# Altium schematic sheet 消防背表 备份.SchDoc
size A2
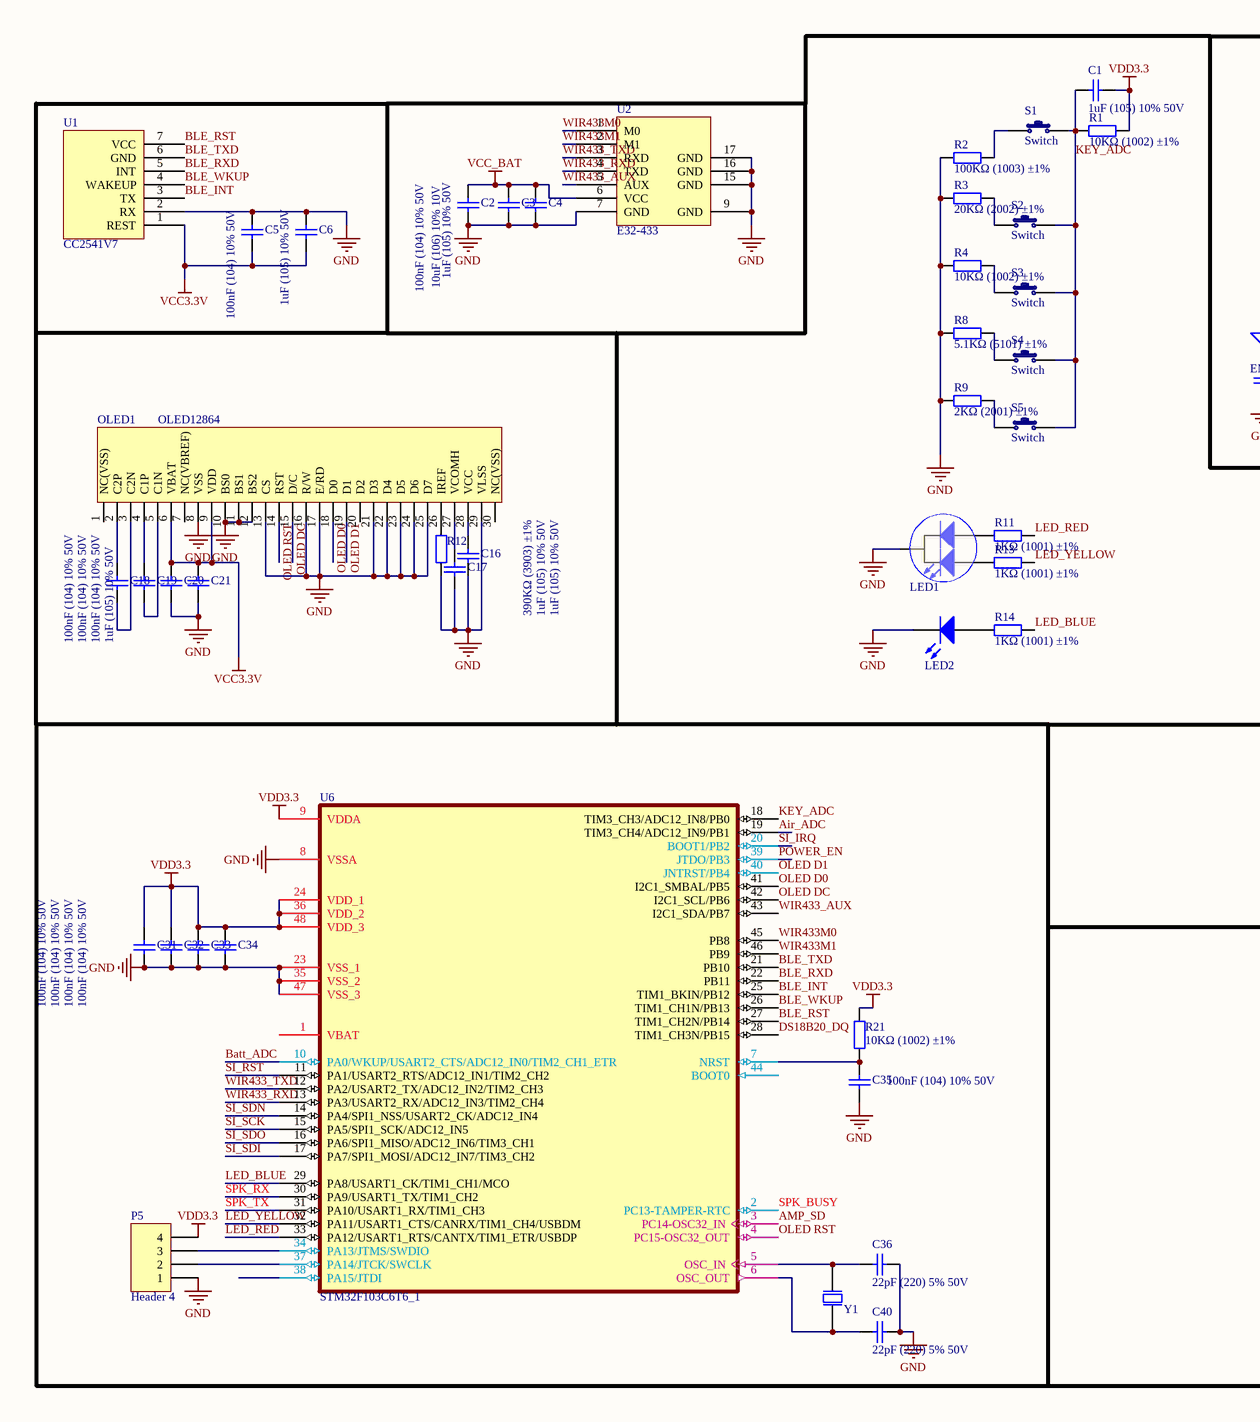
[diagram p0: 消防背表 备份.SchDoc, left]
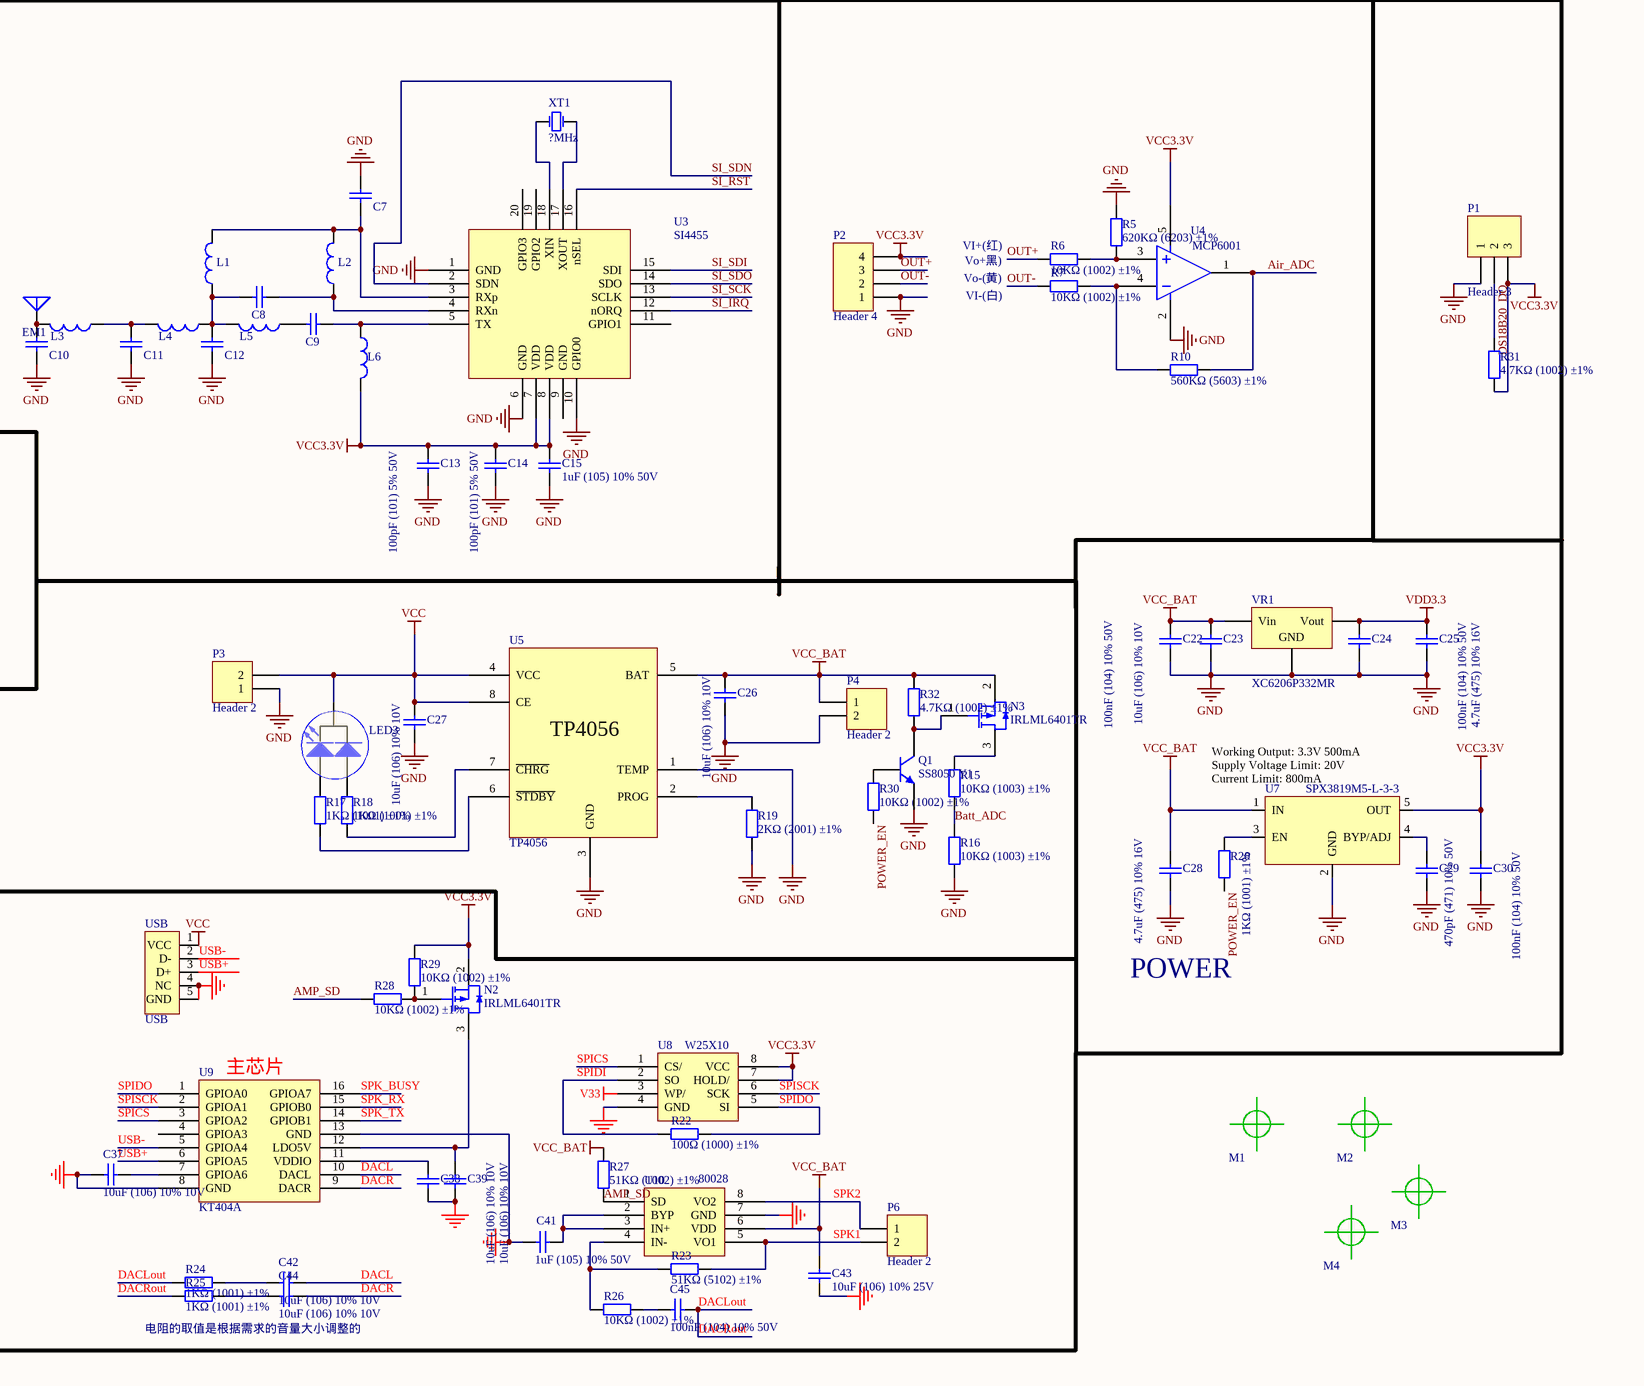
[diagram p1: 消防背表 备份.SchDoc, right]

## Parts
C1  1uF (105) 10% 50V  [0603_C]
C2  1uF (105) 10% 50V  [0603_C]
C3  10uF (106) 10% 10V  [0603_C]
C4  100nF (104) 10% 50V  [0603_C]
C5  100nF (104) 10% 50V  [0603_C]
C6  1uF (105) 10% 50V  [0603_C]
C7  Cap Chip  [CAPC1608N]  (value not drawn)
C8  Cap Chip  [CAPC1608N]  (value not drawn)
C9  Cap Chip  [CAPC1608N]  (value not drawn)
C10  Cap Chip  [CAPC1608N]  (value not drawn)
C11  Cap Chip  [CAPC1608N]  (value not drawn)
C12  Cap Chip  [CAPC1608N]  (value not drawn)
C13  100pF (101) 5% 50V  [0603_C]
C14  100pF (101) 5% 50V  [0603_C]
C15  1uF (105) 10% 50V  [0603_C]
C16  1uF (105) 10% 50V  [0603_C]
C17  1uF (105) 10% 50V  [0603_C]
C18  100nF (104) 10% 50V  [0603_C]
C19  100nF (104) 10% 50V  [0603_C]
C20  100nF (104) 10% 50V  [0603_C]
C21  1uF (105) 10% 50V  [0603_C]
C22  100nF (104) 10% 50V  [0603_C]
C23  10uF (106) 10% 10V  [0603_C]
C24  4.7uF (475) 10% 16V  [0603_C]
C25  100nF (104) 10% 50V  [0603_C]
C26  10uF (106) 10% 10V  [0603_C]
C27  10uF (106) 10% 10V  [0603_C]
C28  4.7uF (475) 10% 16V  [0603_C]
C29  470pF (471) 10% 50V  [0603_C]
C30  100nF (104) 10% 50V  [0603_C]
C31  100nF (104) 10% 50V  [0603_C]
C32  100nF (104) 10% 50V  [0603_C]
C33  100nF (104) 10% 50V  [0603_C]
C34  100nF (104) 10% 50V  [0603_C]
C35  100nF (104) 10% 50V  [0603_C]
C36  22pF (220) 5% 50V  [0603_C]
C37  10uF (106) 10% 10V  [0603_C]
C38  10uF (106) 10% 10V  [0603_C]
C39  10uF (106) 10% 10V  [0603_C]
C40  22pF (220) 5% 50V  [0603_C]
C41  1uF (105) 10% 50V  [0603_C]
C42  10uF (106) 10% 10V  [0603_C]
C43  10uF (106) 10% 25V  [0805_C]
C44  10uF (106) 10% 10V  [0603_C]
C45  100nF (104) 10% 50V  [0603_C]
EM1  Ant_2.4G  [ANT_2.4G]  (value not drawn)
L1  Inductor Chip  [CR1608-0603]  (value not drawn)
L2  Inductor Chip  [CR1608-0603]  (value not drawn)
L3  Inductor Chip  [CR1608-0603]  (value not drawn)
L4  Inductor Chip  [CR1608-0603]  (value not drawn)
L5  Inductor Chip  [CR1608-0603]  (value not drawn)
L6  Inductor Chip  [CR1608-0603]  (value not drawn)
LED1  LED-3-DOUBLE  [LED-R3-H5-DOUBLE]  (value not drawn)
LED2  LED Chip  [CLED1608-0603]  (value not drawn)
LED3  LED-3-DOUBLE  [LED-R3-H5-DOUBLE]  (value not drawn)
M1  Screw Hole  [Screw hexagon 3mm]  (value not drawn)
M2  Screw Hole  [Screw hexagon 3mm]  (value not drawn)
M3  Screw Hole  [Screw hexagon 3mm]  (value not drawn)
M4  Screw Hole  [Screw hexagon 3mm]  (value not drawn)
N2  value IRLML6401TR  [SOT23-3]  (hidden comment: P-MOS)
N3  value IRLML6401TR  [SOT23-3]  (hidden comment: P-MOS)
OLED1  OLED12864  [OLED_0.96]
P1  Header 3  [HX2.54-3]
P2  Header 4  [HX2.54-4]
P3  Header 2  [HDR1X2]
P4  Header 2  [MOLEX 35363-0250]
P5  Header 4  [HDR1X4]
P6  Header 2  [HDR1X2]
Q1  SS8050 Y1  [SOT-23(SOT-23-3)]
R1  10KΩ (1002) ±1%  [0603_R]
R2  100KΩ (1003) ±1%  [0603_R]
R3  20KΩ (2002) ±1%  [0603_R]
R4  10KΩ (1002) ±1%  [0603_R]
R5  620KΩ (6203) ±1%  [0603_R]
R6  10KΩ (1002) ±1%  [0603_R]
R7  10KΩ (1002) ±1%  [0603_R]
R8  5.1KΩ (5101) ±1%  [0603_R]
R9  2KΩ (2001) ±1%  [0603_R]
R10  560KΩ (5603) ±1%  [0603_R]
R11  1KΩ (1001) ±1%  [0603_R]
R12  390KΩ (3903) ±1%  [0603_R]
R13  1KΩ (1001) ±1%  [0603_R]
R14  1KΩ (1001) ±1%  [0603_R]
R15  10KΩ (1003) ±1%  [0603_R]
R16  10KΩ (1003) ±1%  [0603_R]
R17  1KΩ (1001) ±1%  [0603_R]
R18  1KΩ (1001) ±1%  [0603_R]
R19  2KΩ (2001) ±1%  [0603_R]
R20  1KΩ (1001) ±1%  [0603_R]
R21  10KΩ (1002) ±1%  [0603_R]
R22  100Ω (1000) ±1%  [0603_R]
R23  51KΩ (5102) ±1%  [0603_R]
R24  1KΩ (1001) ±1%  [0603_R]
R25  1KΩ (1001) ±1%  [0603_R]
R26  10KΩ (1002) ±1%  [0603_R]
R27  51KΩ (1002) ±1%  [0603_R]
R28  10KΩ (1002) ±1%  [0603_R]
R29  10KΩ (1002) ±1%  [0603_R]
R30  10KΩ (1002) ±1%  [0603_R]
R31  4.7KΩ (1002) ±1%  [0603_R]
R32  4.7KΩ (1002) ±1%  [0603_R]
S1  Switch  [Switch1]
S2  Switch  [Switch1]
S3  Switch  [Switch1]
S4  Switch  [Switch1]
S5  Switch  [Switch1]
U1  CC2541V7  [BLE_CC2451]
U2  E32-433  [E32_433]
U3  SI4455  [QFN50P300X300X80-20N]
U4  MCP6001  [SOT23-5]
U5  TP4056  [SOP-8_150mil]
U6  STM32F103C6T6_1  [LQFP-48]
U7  SPX3819M5-L-3-3  [SOT-23-6]
U8  W25X10  [SOIC127P790X265-8N]
U9  KT404A  [SOP-16M]
U10  80028  [SOP-8_150mil]
USB  USB  [USB-MICRO-B]
VR1  XC6206P332MR  [SOT-23-3L]
XT1  value ?MHz  [XTAL_5032]  (hidden comment: XTAL_5032)
Y1  XTAL  [XTAL-SMD]  (value not drawn)

## Nets
GND: C2.1 C3.1 C4.1 C5.2 C6.2 C7.2 C10.1 C11.1 C12.1 C13.2 C14.2 C15.1 C16.1 C17.1 C20.1 C21.1 C22.1 C23.1 C24.1 C25.1 C26.1 C27.1 C28.1 C29.1 C30.1 C31.1 C32.1 C33.1 C34.1 C35.1 C36.2 C37.2 C38.2 C39.2 C40.2 C41.1 C43.1 LED1.1(K) LED2.2(K) OLED1.8(VSS) OLED1.10(BS0) OLED1.11(BS1) OLED1.12(BS2) OLED1.13(CS) OLED1.16(R/W) OLED1.17(E/RD) OLED1.21(D3) OLED1.22(D4) OLED1.23(D5) OLED1.24(D6) OLED1.25(D7) OLED1.29(VLSS) P1.1 P2.1 P3.1 P4.2 P5.1 Q1.2(E) R2.1 R3.1 R4.1 R5.2 R8.1 R9.1 R12.1 R16.1 R19.1 U1.2(RX) U2.7(GND) U2.9(GND) U2.15(GND) U2.16(GND) U2.17(GND) U3.1(GND) U3.6(GND) U3.10(GPIO0) U4.2 U5.1(TEMP) U5.3(GND) U6.8(VSSA) U6.23(VSS_1) U6.35(VSS_2) U6.47(VSS_3) U7.2(GND) U8.4(GND) U9.8(GND) U9.13(GND) U10.7(GND) USB.4(NC) USB.5(GND) VR1.1(GND)
V33: U8.3(WP/)
VCC: C27.2 LED3.1(K) P3.2 U5.4(VCC) U5.8(CE) USB.1(VCC)
VCC3.3V: C5.1 C6.1 C13.1 C14.1 C15.2 C20.2 C21.2 C30.2 L6.2 N2.2(S) OLED1.6(VBAT) OLED1.9(VDD) P1.3 P2.4 R29.1 R31.2 U1.1(REST) U3.7(VDD) U3.8(VDD) U4.5 U7.5(OUT) U8.7(HOLD/) U8.8(VCC)
VCC_BAT: C2.2 C3.2 C4.2 C22.2 C23.2 C26.2 C28.2 C43.2 N3.2(S) P4.1 R27.2 R32.1 U2.6(VCC) U5.5(BAT) U7.1(IN) U10.6(VDD) VR1.3(Vin)
VDD3.3: C1.1 C24.2 C25.2 C31.2 C32.2 C33.2 C34.2 P5.4 R1.2 R21.2 U6.9(VDDA) U6.24(VDD_1) U6.36(VDD_2) U6.48(VDD_3) VR1.2(Vout)
Air_ADC: R10.2 U4.1 U6.19(TIM3_CH4/ADC12_IN9/PB1)
AMP_SD: R27.1 R28.2 U6.3(PC14-OSC32_IN) U10.1(SD)
Batt_ADC: R15.1 R16.2 U6.10(PA0/WKUP/USART2_CTS/ADC12_IN0/TIM2_CH1_ETR)
BLE_INT: U1.3(TX) U6.25(TIM1_BKIN/PB12)
BLE_RST: U1.7(VCC) U6.27(TIM1_CH2N/PB14)
BLE_RXD: U1.5(INT) U6.22(PB11)
BLE_TXD: U1.6(GND) U6.21(PB10)
BLE_WKUP: U1.4(WAKEUP) U6.26(TIM1_CH1N/PB13)
DACL: C42.1 U9.10(DACL)
DACLout: C45.1 R24.2 R25.2  [also labelled DACRout]
DACR: C44.1 U9.9(DACR)
DS18B20_DQ: P1.2 R31.1 U6.28(TIM1_CH3N/PB15)
KEY_ADC: C1.2 R1.1 S1.2 S2.2 S3.2 S4.2 S5.2 U6.18(TIM3_CH3/ADC12_IN8/PB0)
LED_BLUE: R14.1 U6.29(PA8/USART1_CK/TIM1_CH1/MCO)
LED_RED: R11.1 U6.33(PA12/USART1_RTS/CANTX/TIM1_ETR/USBDP)
LED_YELLOW: R13.1 U6.32(PA11/USART1_CTS/CANRX/TIM1_CH4/USBDM)
OLED D0: OLED1.18(D0) U6.41(I2C1_SMBAL/PB5)
OLED D1: OLED1.19(D1) U6.40(JNTRST/PB4)
OLED DC: OLED1.15(D/C) U6.42(I2C1_SCL/PB6)
OLED RST: OLED1.14(RST) U6.4(PC15-OSC32_OUT)
OUT+: P2.3 R6.1
OUT-: P2.2 R7.1
POWER_EN: R20.2 R30.2 U6.39(JTDO/PB3)
SI_IRQ: U3.12(nORQ) U6.20(BOOT1/PB2)
SI_RST: U3.16(nSEL) U6.11(PA1/USART2_RTS/ADC12_IN1/TIM2_CH2)
SI_SCK: U3.13(SCLK) U6.15(PA5/SPI1_SCK/ADC12_IN5)
SI_SDI: U3.15(SDI) U6.17(PA7/SPI1_MOSI/ADC12_IN7/TIM3_CH2)
SI_SDN: U3.2(SDN) U6.14(PA4/SPI1_NSS/USART2_CK/ADC12_IN4)
SI_SDO: U3.14(SDO) U6.16(PA6/SPI1_MISO/ADC12_IN6/TIM3_CH1)
SPICS: U8.1(CS/) U9.3(GPIOA2)
SPIDI: R22.1 U8.2(SO)
SPIDO: R22.2 U8.5(SI) U9.1(GPIOA0)
SPISCK: U8.6(SCK) U9.2(GPIOA1)
SPK1: P6.2 R23.2 U10.5(VO1)
SPK2: P6.1 U10.8(VO2)
SPK_BUSY: U6.2(PC13-TAMPER-RTC) U9.16(GPIOA7)
SPK_RX: U6.30(PA9/USART1_TX/TIM1_CH2) U9.15(GPIOB0)
SPK_TX: U6.31(PA10/USART1_RX/TIM1_CH3) U9.14(GPIOB1)
USB+: U9.6(GPIOA5) USB.3(D+)
USB-: U9.5(GPIOA4) USB.2(D-)
WIR433_AUX: U2.5(AUX) U6.43(I2C1_SDA/PB7)
WIR433_RXD: U2.4(TXD) U6.13(PA3/USART2_RX/ADC12_IN3/TIM2_CH4)
WIR433_TXD: U2.3(RXD) U6.12(PA2/USART2_TX/ADC12_IN2/TIM2_CH3)
WIR433M0: U2.1(M0) U6.45(PB8)
WIR433M1: U2.2(M1) U6.46(PB9)
NetC7_1: C7.1 L1.2 L2.2 U3.3(RXp)
NetC8_1: C8.1 L2.1 U3.4(RXn)
NetC8_2: C8.2 C12.2 L1.1 L4.1 L5.2
NetC9_1: C9.1 L6.1 U3.5(TX)
NetC9_2: C9.2 L5.1
NetC10_2: C10.2 EM1.1(A) L3.2
NetC11_2: C11.2 L3.1 L4.2
NetC16_2: C16.2 OLED1.28(VCC)
NetC17_2: C17.2 OLED1.27(VCOMH)
NetC18_1: C18.1 OLED1.3(C2N)
NetC18_2: C18.2 OLED1.2(C2P)
NetC19_1: C19.1 OLED1.5(C1N)
NetC19_2: C19.2 OLED1.4(C1P)
NetC29_2: C29.2 U7.4(BYP/ADJ)
NetC35_2: C35.2 R21.1 U6.7(NRST)
NetC36_1: C36.1 U6.5(OSC_IN) Y1.2(OSC2)
NetC37_1: C37.1 U9.7(GPIOA6)
NetC38_1: C38.1 U9.11(VDDIO)
NetC39_1: C39.1 N2.3(D) U9.12(LDO5V)
NetC40_1: C40.1 U6.6(OSC_OUT) Y1.1(OSC1)
NetC41_2: C41.2 U10.2(BYP) U10.3(IN+)
NetC42_2: C42.2 R24.1
NetC44_2: C44.2 R25.1
NetC45_2: C45.2 R26.2
NetLED1_2: LED1.2(A) R13.2
NetLED1_3: LED1.3(A) R11.2
NetLED2_1: LED2.1(A) R14.2
NetLED3_2: LED3.2(A) R17.2
NetLED3_3: LED3.3(A) R18.2
NetN2_1: N2.1(G) R28.1 R29.2
NetN3_1: N3.1(G) Q1.3(C) R32.2
NetN3_3: N3.3(D) R15.2
NetOLED1_26: OLED1.26(IREF) R12.2
NetP5_2: P5.2 U6.37(PA14/JTCK/SWCLK)
NetP5_3: P5.3 U6.34(PA13/JTMS/SWDIO)
NetQ1_1: Q1.1(B) R30.1
NetR2_2: R2.2 S1.1
NetR3_2: R3.2 S2.1
NetR4_2: R4.2 S3.1
NetR5_1: R5.1 R6.2 U4.3
NetR7_2: R7.2 R10.1 U4.4
NetR8_2: R8.2 S4.1
NetR9_2: R9.2 S5.1
NetR17_1: R17.1 U5.6(~{STDBY})
NetR18_1: R18.1 U5.7(~{CHRG})
NetR19_2: R19.2 U5.2(PROG)
NetR20_1: R20.1 U7.3(EN)
NetR23_1: R23.1 R26.1 U10.4(IN-)
NetU3_17: U3.17(XOUT) XT1.2(OSC2)
NetU3_18: U3.18(XIN) XT1.1(OSC1)

Not connected (* = marked no-connect by the designer): OLED1 1(NC(VSS)) 7(NC(VBREF)) 20(D2) 30(NC(VSS)); U3 9(GND) 11(GPIO1) 19(GPIO2) 20(GPIO3); U6 1(VBAT) 38(PA15/JTDI) 44(BOOT0); U9 4(GPIOA3)

## Notes on the sheet
- VI+(红)
- Vo-(黄)
- Vo+黑)
- VI-(白)
- (near U7) Working Output: 3.3V 500mA
  Supply Voltage Limit: 20V
  Current Limit: 800mA
- POWER
- (near U9) 主芯片
- 电阻的取值是根据需求的音量大小调整的

## Library data of the parts
C1 C2 C6 C15-C17 C21 C41 = 0603 1uF (105) 10% 50V: 贴片电容; ComponentLink1Description: 供应商链接; ComponentLink1URL: http://www.szlcsc.com/product/details_16531.html; Package: 0603; Supplier: LC; SuppliersPartNumber: C15849
C3 C23 C26 C27 C37-C39 C42 C44 = 0603 10uF (106) 10% 10V: 贴片电容; ComponentLink1Description: 供应商链接; ComponentLink1URL: http://www.szlcsc.com/product/details_20411.html; Package: 0603; Supplier: LC; SuppliersPartNumber: C19702
C4 C5 C18-C20 C22 C25 C30-C35 C45 = 0603 100nF (104) 10% 50V: 贴片电容; ComponentLink1Description: 供应商链接; ComponentLink1URL: http://www.szlcsc.com/product/details_15331.html; Package: 0603; Supplier: LC; SuppliersPartNumber: C14663
C7-C12 = Cap Chip: Polarized Capacitor (Radial); Value: 104; Published: 8-Jun-2000; Revision: July-2002: Re-released for DXP Platform.; Publisher: Altium Limited
C13 C14 = 0603 100pF (101) 5% 50V: 贴片电容; ComponentLink1Description: 供应商链接; ComponentLink1URL: http://www.szlcsc.com/product/details_15530.html; Package: 0603; Supplier: LC; SuppliersPartNumber: C14858
C24 C28 = 0603 4.7uF (475) 10% 16V: 贴片电容; ComponentLink1Description: 供应商链接; ComponentLink1URL: http://www.szlcsc.com/product/details_20375.html; Package: 0603; Supplier: LC; SuppliersPartNumber: C19666
C29 = 0603 470pF (471) 10% 50V: 贴片电容; ComponentLink1Description: 供应商链接; ComponentLink1URL: http://www.szlcsc.com/product/details_1972.html; Package: 0603; Supplier: LC; SuppliersPartNumber: C1620
C36 C40 = 0603 22pF (220) 5% 50V: 贴片电容; ComponentLink1Description: 供应商链接; ComponentLink1URL: http://www.szlcsc.com/product/details_2005.html; Package: 0603; Supplier: LC; SuppliersPartNumber: C1653
C43 = 0805 10uF (106) 10% 25V: 贴片电容; ComponentLink1Description: 供应商链接; ComponentLink1URL: http://www.szlcsc.com/product/details_16532.html; Package: 0805; Supplier: LC; SuppliersPartNumber: C15850
EM1 = Ant_2.4G: Antenna
L1-L6 = Inductor Chip: Inductor; Value: 100uH; Published: 8-Jun-2000; Revision: July-2002: Re-released for DXP Platform.; Publisher: Altium Limited
LED1 LED3 = LED-3-DOUBLE: Typical INFRARED GaAs LED; Published: 8-Jun-2000; Revision: July-2002: Re-released for DXP Platform.; Publisher: Altium Limited
LED2 = LED Chip: Typical Chip LED; Published: 8-Jun-2000; Revision: July-2002: Re-released for DXP Platform.; Publisher: Altium Limited
P1 = Header 3: Header, 3-Pin; LatestRevisionDate: 17-Jul-2002; LatestRevisionNote: Re-released for DXP Platform.; Publisher: Altium Limited
P2 P5 = Header 4: Header, 4-Pin; LatestRevisionDate: 17-Jul-2002; LatestRevisionNote: Re-released for DXP Platform.; Publisher: Altium Limited
P3 P4 P6 = Header 2: Header, 2-Pin; LatestRevisionDate: 17-Jul-2002; LatestRevisionNote: Re-released for DXP Platform.; Publisher: Altium Limited
Q1 = SOT-23 SS8050 Y1: 三极管; ComponentLink1Description: 供应商链接; ComponentLink1URL: http://www.szlcsc.com/product/details_2507.html; Package: SOT-23; Supplier: LC; SuppliersPartNumber: C2150
R1 R4 R6 R7 R21 R26-R32 = 0603 10KΩ (1002) 1%: 贴片电阻; ComponentLink1Description: 供应商链接; ComponentLink1URL: http://www.szlcsc.com/product/details_26547.html; Package: 0603; Supplier: LC; SuppliersPartNumber: C25804
R2 R15 R16 = 0603 100KΩ (1003) 1%: 贴片电阻; ComponentLink1Description: 供应商链接; ComponentLink1URL: http://www.szlcsc.com/product/details_26546.html; Package: 0603; Supplier: LC; SuppliersPartNumber: C25803
R3 = 0603 20KΩ (2002) 1%: 贴片电阻; ComponentLink1Description: 供应商链接; ComponentLink1URL: http://www.szlcsc.com/product/details_4591.html; Package: 0603; Supplier: LC; SuppliersPartNumber: C4184
R5 = 0603 620KΩ (6203) 1%: 贴片电阻; ComponentLink1Description: 供应商链接; ComponentLink1URL: http://www.szlcsc.com/product/details_23946.html; Package: 0603; Supplier: LC; SuppliersPartNumber: C23219
R8 = 0603 5.1KΩ (5101) 1%: 贴片电阻; ComponentLink1Description: 供应商链接; ComponentLink1URL: http://www.szlcsc.com/product/details_23913.html; Package: 0603; Supplier: LC; SuppliersPartNumber: C23186
R9 R19 = 0603 2KΩ (2001) 1%: 贴片电阻; ComponentLink1Description: 供应商链接; ComponentLink1URL: http://www.szlcsc.com/product/details_23702.html; Package: 0603; Supplier: LC; SuppliersPartNumber: C22975
R10 = 0603 560KΩ (5603) 1%: 贴片电阻; ComponentLink1Description: 供应商链接; ComponentLink1URL: http://www.szlcsc.com/product/details_23930.html; Package: 0603; Supplier: LC; SuppliersPartNumber: C23203
R11 R13 R14 R17 R18 R20 R24 R25 = 0603 1KΩ (1001) 1%: 贴片电阻; ComponentLink1Description: 供应商链接; ComponentLink1URL: http://www.szlcsc.com/product/details_21904.html; Package: 0603; Supplier: LC; SuppliersPartNumber: C21190
R12 = 0603 390KΩ (3903) 1%: 贴片电阻; ComponentLink1Description: 供应商链接; ComponentLink1URL: http://www.szlcsc.com/product/details_23877.html; Package: 0603; Supplier: LC; SuppliersPartNumber: C23150
R22 = 0603 100Ω (1000) 1%: 贴片电阻; ComponentLink1Description: 供应商链接; ComponentLink1URL: http://www.szlcsc.com/product/details_23502.html; Package: 0603; Supplier: LC; SuppliersPartNumber: C22775
R23 = 0603 51KΩ (5102) 1%: 贴片电阻; ComponentLink1Description: 供应商链接; ComponentLink1URL: http://www.szlcsc.com/product/details_23923.html; Package: 0603; Supplier: LC; SuppliersPartNumber: C23196
U6 = STM32F103C6T6_1: STM32 ARM-based 32-bit MCU with 32 Kbytes Flash, 48-pin LQFP, Industrial Temperature; Published: *; DatasheetVersion: *; PackageVersion: *; PackageReference: *; Publisher: *; PackageDescription: *; ComponentLink1Description: *; ComponentLink1URL: *; ComponentLink2Description: *; ComponentLink2URL: *
U7 = SPX3819: 500mA, Low-Noise LDO Voltage Regulator; pin to pad: 5>6
USB = USB5
VR1 = SOT-23 XC6206P332MR: 低压差线性稳压(LDO); ComponentLink1Description: 供应商链接; ComponentLink1URL: http://www.szlcsc.com/product/details_5896.html; Package: SOT-23; Supplier: LC; SuppliersPartNumber: C5446
XT1 = XTAL_5032: Crystal Oscillator; Published: 8-Jun-2000; LatestRevisionDate: 17-Jul-2002; LatestRevisionNote: Re-released for DXP Platform.; PackageReference: R38; Publisher: Altium Limited; PackageDescription: Crystal, Thru-Hole; 2 Leads; Body 3.1 x 8.2 mm (Dia.xH)
Y1 = XTAL: Crystal Oscillator; Published: 8-Jun-2000; Revision: July-2002: Re-released for DXP Platform.; Publisher: Altium Limited